# EAGLE schematic ANET3D_LCD2004_board (EAGLE 6.6.0)
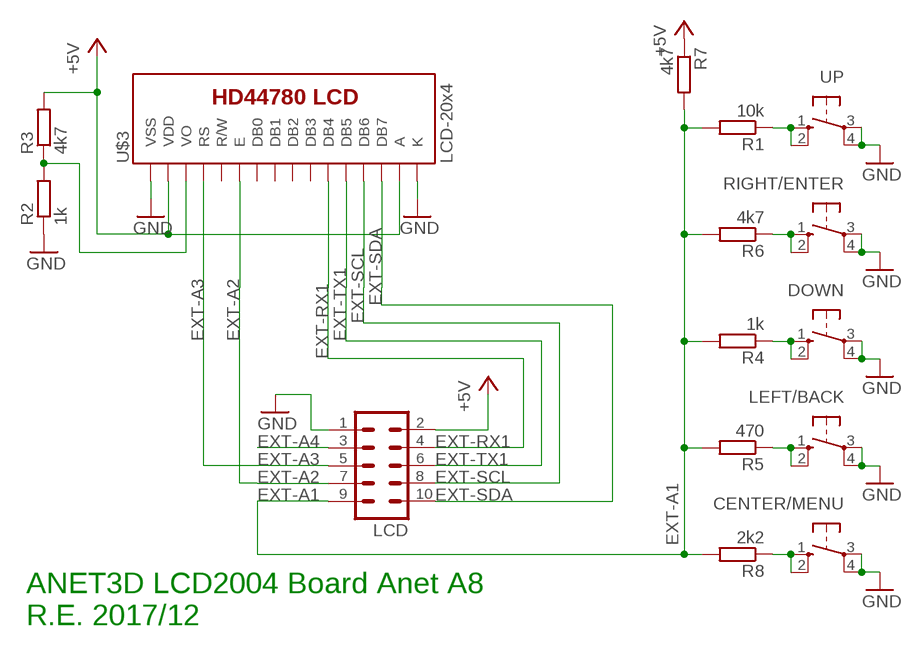
[diagram p0: schematic, sheet 1]

## Parts
CENTER/MENU  40-XX  [B3F-40XX]
DOWN  40-XX  [B3F-40XX]
LCD1  LCD  ML10  [ML10]
LEFT/BACK  40-XX  [B3F-40XX]
R1  10k  R-EU_R0805  [R0805]
R2  1k  R-EU_R0805  [R0805]
R3  4k7  R-EU_R0805  [R0805]
R4  1k  R-EU_R0805  [R0805]
R5  470  R-EU_R0805  [R0805]
R6  4k7  R-EU_R0805  [R0805]
R7  4k7  R-EU_R0805  [R0805]
R8  2k2  R-EU_R0805  [R0805]
RIGHT/ENTER  40-XX  [B3F-40XX]
U$3  LCD-20x4  LCD-HD447804-HOLES20X4-4HOLES  [LCD-20X4-4HOLES]
UP  40-XX  [B3F-40XX]

## Nets
+5V [power]: LCD1.2 R3.2 R7.1 U$3.P$2(VDD) U$3.P$15(A)
EXT-A1: LCD1.9 R1.2 R4.2 R5.2 R6.2 R7.2 R8.2
EXT-A2: LCD1.7 U$3.P$6(E)
EXT-A3: LCD1.5 U$3.P$4(RS)
EXT-A4: LCD1.3
EXT-RX1: LCD1.4 U$3.P$11(DB4)
EXT-SCL: LCD1.8 U$3.P$13(DB6)
EXT-SDA: LCD1.10 U$3.P$14(DB7)
EXT-TX1: LCD1.6 U$3.P$12(DB5)
GND: CENTER/MENU.3(P) CENTER/MENU.4(P1) DOWN.3(P) DOWN.4(P1) LCD1.1 LEFT/BACK.3(P) LEFT/BACK.4(P1) R2.1 RIGHT/ENTER.3(P) RIGHT/ENTER.4(P1) U$3.P$1(VSS) U$3.P$16(K) UP.3(P) UP.4(P1)
N$3: DOWN.1(S) DOWN.2(S1) R4.1
N$4: LEFT/BACK.1(S) LEFT/BACK.2(S1) R5.1
N$5: CENTER/MENU.1(S) CENTER/MENU.2(S1) R8.1
N$6: R6.1 RIGHT/ENTER.1(S) RIGHT/ENTER.2(S1)
N$7: R1.1 UP.1(S) UP.2(S1)
N$8: R2.2 R3.1 U$3.P$3(VO)
Unconnected: U$3.P$5(R/W) U$3.P$7(DB0) U$3.P$8(DB1) U$3.P$9(DB2) U$3.P$10(DB3)

## Notes on the sheet
- ANET3D LCD2004 Board Anet A8
  R.E. 2017/12

## Library data of the parts
CENTER/MENU DOWN LEFT/BACK RIGHT/ENTER UP = switch-omron:40-XX: OMRON SWITCH; MF: OMRON COMPONENTS USA; MPN: B3F-4000; OC_FARNELL: 176434; OC_NEWARK: 36K3105
LCD1 = con-harting-ml:ML10: HARTING; OC_FARNELL: unknown; OC_NEWARK: unknown
R1-R8 = rcl:R-EU_: RESISTOR, European symbol
U$3 = HD44780LCD:LCD-HD44780